# Altium project POWR0001_BCR_LT1513.PrjPcb
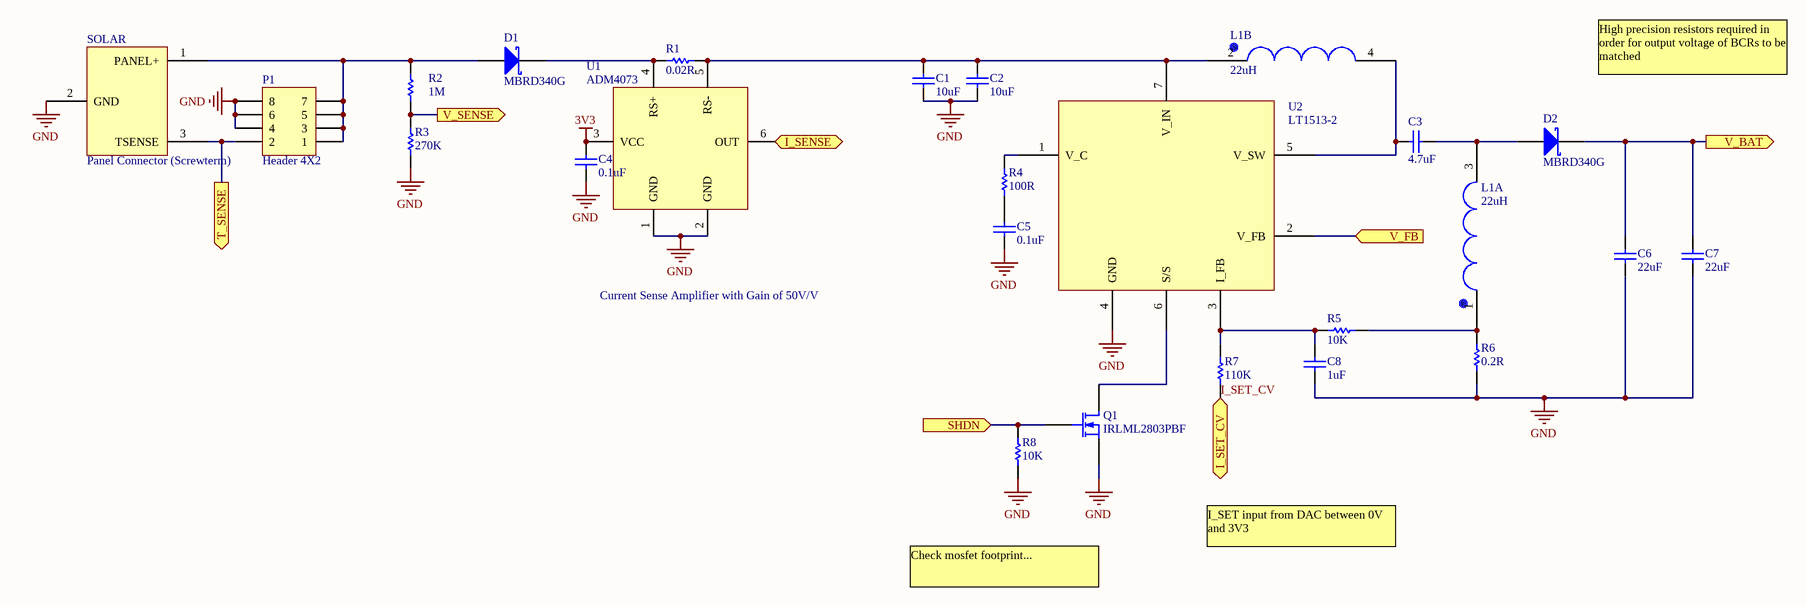
[diagram p0: POWR0001_BCR_LT1513.SchDoc]
1 sheet, 24 parts. Net scope: flat (ports and power ports of the same name join across sheets).
Board file: POWR0001_BCR_LT1513.PcbDoc

## Sheet POWR0001_BCR_LT1513.SchDoc: BLUEsat Battery Charge Regulator
size A3; Engineer: T. FISK; Organization: BLUEsat Project; Address1: Room 419; Address2: School of EE&T; Address3: UNSW, NSW 2052; Address4: Australia; DocumentNumber: POWR0001; SheetNumber: 1; SheetTotal: 1; Description: Battery charge regulator based on LT1513-2; Version: 4

### Parts
C1  value 10uF  [CAPC3225M]  (hidden comment: Cap)
C2  value 10uF  [CAPC3225M]  (hidden comment: Cap)
C3  value 4.7uF  [CAPC3225M]  (hidden comment: Cap)
C4  value 0.1uF  [CAPC2012M]  (hidden comment: Cap)
C5  value 0.1uF  [CAPC2012M]  (hidden comment: Cap)
C6  value 22uF  [CAPC4532M]  (hidden comment: Cap)
C7  value 22uF  [CAPC4532M]  (hidden comment: Cap)
C8  value 1uF  [CAPC2012M]  (hidden comment: Cap)
D1  MBRD340G  [TO229P990X238-3N]
D2  MBRD340G  [TO229P990X238-3N]
L1  value 22uH  [DRQ125]  (hidden comment: DRQ125 Dual Inductor)  (parts A,B of 2)
P1  Header 4X2  [HDR2X4]
Q1  IRLML2803PBF  [SOT-23_N]
R1  value 0.02R  [RESC2012M]  (hidden comment: Res1)
R2  value 1M  [RESC2012M]  (hidden comment: Res1)
R3  value 270K  [RESC2012M]  (hidden comment: Res1)
R4  value 100R  [RESC2012M]  (hidden comment: Res1)
R5  value 10K  [RESC2012M]  (hidden comment: Res1)
R6  value 0.2R  [RESC2012M]  (hidden comment: Res1)
R7  value 110K  [RESC2012M]  (hidden comment: Res1)
R8  value 10K  [RESC2012M]  (hidden comment: Res1)
SOLAR  Panel Connector (Screwterm)  [5.05mm Terminal Block - 3]
U1  ADM4073  [SOT95P285X145-6N]
U2  LT1513-2  [TO152P1396X238-8N]

### Ports
I_SENSE (out), I_SET_CV (in), SHDN (in), T_SENSE (out), V_BAT (out), V_FB (in), V_SENSE (out)

### Nets
3V3: C4.1 U1.3(VCC)
GND: C1.2 C2.2 C4.2 C5.2 C6.2 C7.2 C8.1 P1.4 P1.6 P1.8 Q1.3(S) R3.2 R6.1 R8.2 SOLAR.2(GND) U1.1(GND) U1.2(GND) U2.4(GND)
I_SET_CV: R7.2 ; port I_SET_CV
NetC1_1: C1.1 C2.1 L1.2 R1.1 U1.5(RS-) U2.7(V_IN)
NetC3_1: C3.1 D2.1(A) L1.3
NetC3_2: C3.2 L1.4 U2.5(V_SW)
NetC5_1: C5.1 R4.2
NetC6_1: C6.1 C7.1 D2.2(K) ; port V_BAT
NetC8_2: C8.2 R5.2 R7.1 U2.3(I_FB)
NetD1_1: D1.1(A) P1.1 P1.3 P1.5 P1.7 R2.1 SOLAR.1(PANEL+)
NetD1_2: D1.2(K) R1.2 U1.4(RS+)
NetL1_1: L1.1 R5.1 R6.2
NetP1_2: P1.2 SOLAR.3(TSENSE) ; port T_SENSE
NetQ1_1: Q1.1(D) U2.6(S/S)
NetQ1_2: Q1.2(G) R8.1 ; port SHDN
NetR2_2: R2.2 R3.1 ; port V_SENSE
NetR4_1: R4.1 U2.1(V_C)
NetU1_6: U1.6(OUT) ; port I_SENSE
NetU2_2: U2.2(V_FB) ; port V_FB

### Notes on the sheet
- High precision resistors required in order for output voltage of BCRs to be matched
- Current Sense Amplifier with Gain of 50V/V
- I_SET input from DAC between 0V and 3V3
- Check mosfet footprint...
- Title
- Size:
- Date:
- A3
- Number:
- Time:
- Revision:
- Sheet
- of
- File:

### Library data of the parts
C1-C8 = Cap: Capacitor; Published: 8-Jun-2000; LatestRevisionDate: 17-Jul-2002; LatestRevisionNote: Re-released for DXP Platform.; PackageReference: RAD-0.3; Publisher: Altium Limited; PackageDescription: Radial Cap, Thru-Hole; 2 Leads; 0.3 in Pin Spacing; Supplier 1: Farnell; Supplier 2: Farnell
  C1 C2: Supplier Part Number 2: 1844365
  C3: Supplier Part Number 2: 1844381
  C4 C5: Supplier Part Number 2: 1759265
  C6 C7: Supplier Part Number 2: 1844378
  C8: Supplier Part Number 2: 1168132
D1 D2 = Diode 11DQ03: Schottky Rectifier; Published: 8-Jun-2000; LatestRevisionDate: 17-Jul-2002; LatestRevisionNote: Re-released for DXP Platform.; DatasheetVersion: Dec-1997; PackageReference: DO-204AL; Publisher: Altium Limited; PackageDescription: Diode, Axial; Body 5.2 x 2.7 mm (LxDia. max), Lead Dia. 0.86 mm (max); Code_JEDEC: DO-204-AL; ComponentLink1Description: Manufacturer Link; ComponentLink1URL: http://www.irf.com/; ComponentLink2Description: Datasheet; ComponentLink2URL: http://www.irf.com/product-info/datasheets/data/11dq03.pdf; Supplier 1: Farnell; Supplier Part Number 1: 1431096
P1 = Header 4X2: Header, 4-Pin, Dual row; LatestRevisionDate: 17-Jul-2002; LatestRevisionNote: Re-released for DXP Platform.; Publisher: Altium Limited
Q1 = MOSFET-N: N-Channel MOSFET; pin to pad: 1>3 2>1 3>2; Published: 8-Jun-2000; LatestRevisionDate: 17-Jul-2002; LatestRevisionNote: Re-released for DXP Platform.; PackageVersion: 1995/1996; PackageReference: E3; Publisher: Altium Limited; PackageDescription: TO, Flat Index; 3 In-Line, Axial Leads; Body Dia. 4.6mm; Lead Dia. 0.5 mm (max)
R1-R8 = Res1: Resistor; Published: 8-Jun-2000; LatestRevisionDate: 17-Jul-2002; LatestRevisionNote: Re-released for DXP Platform.; PackageReference: AXIAL-0.3; Publisher: Altium Limited; PackageDescription: Axial Device, Thru-Hole; 2 Leads; 0.3 in Pin Spacing; Supplier 1: Farnell
SOLAR = Solar Panel Connector
U1 = ADM4073: Current Sense Amplifer
U2 = LT1513: Supplier 1: Farnell; Supplier Part Number 1: 1648008